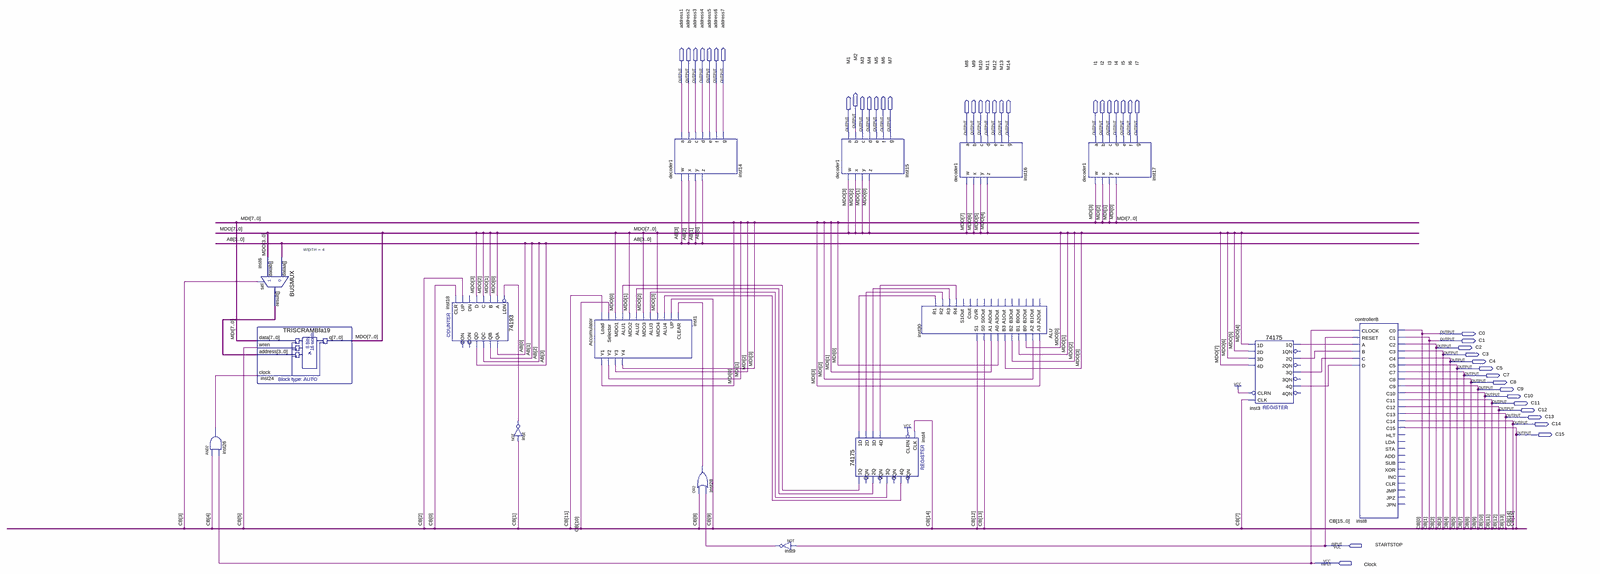
[diagram p0: schematic sheet, whole]
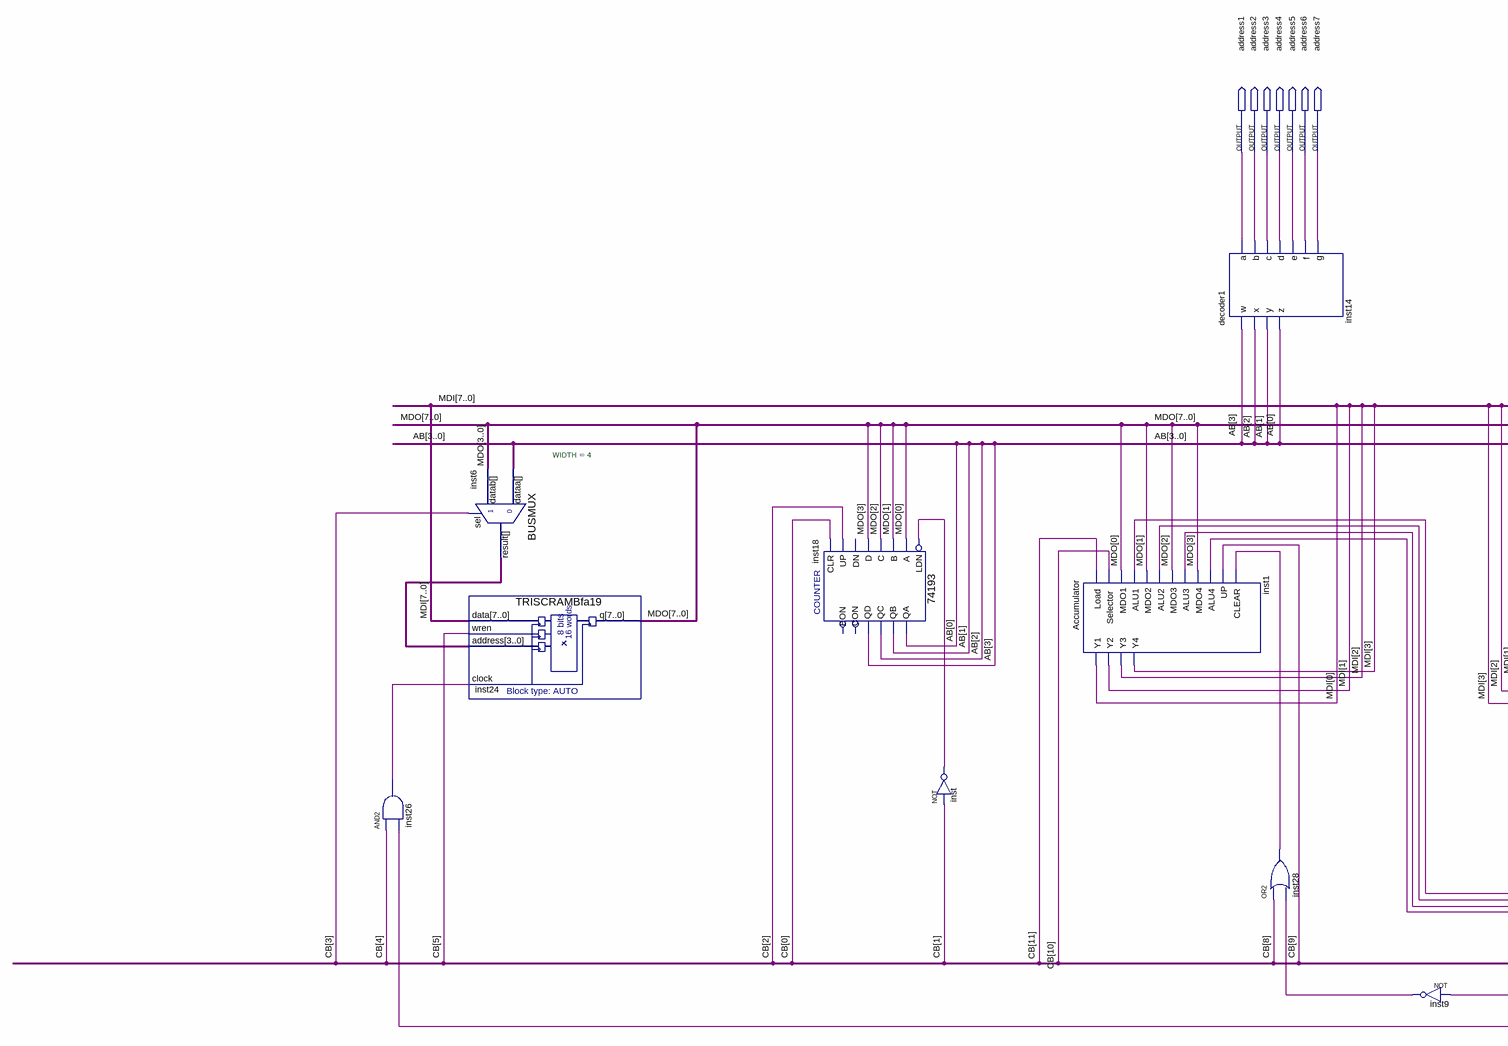
[diagram p1: schematic sheet, left part]
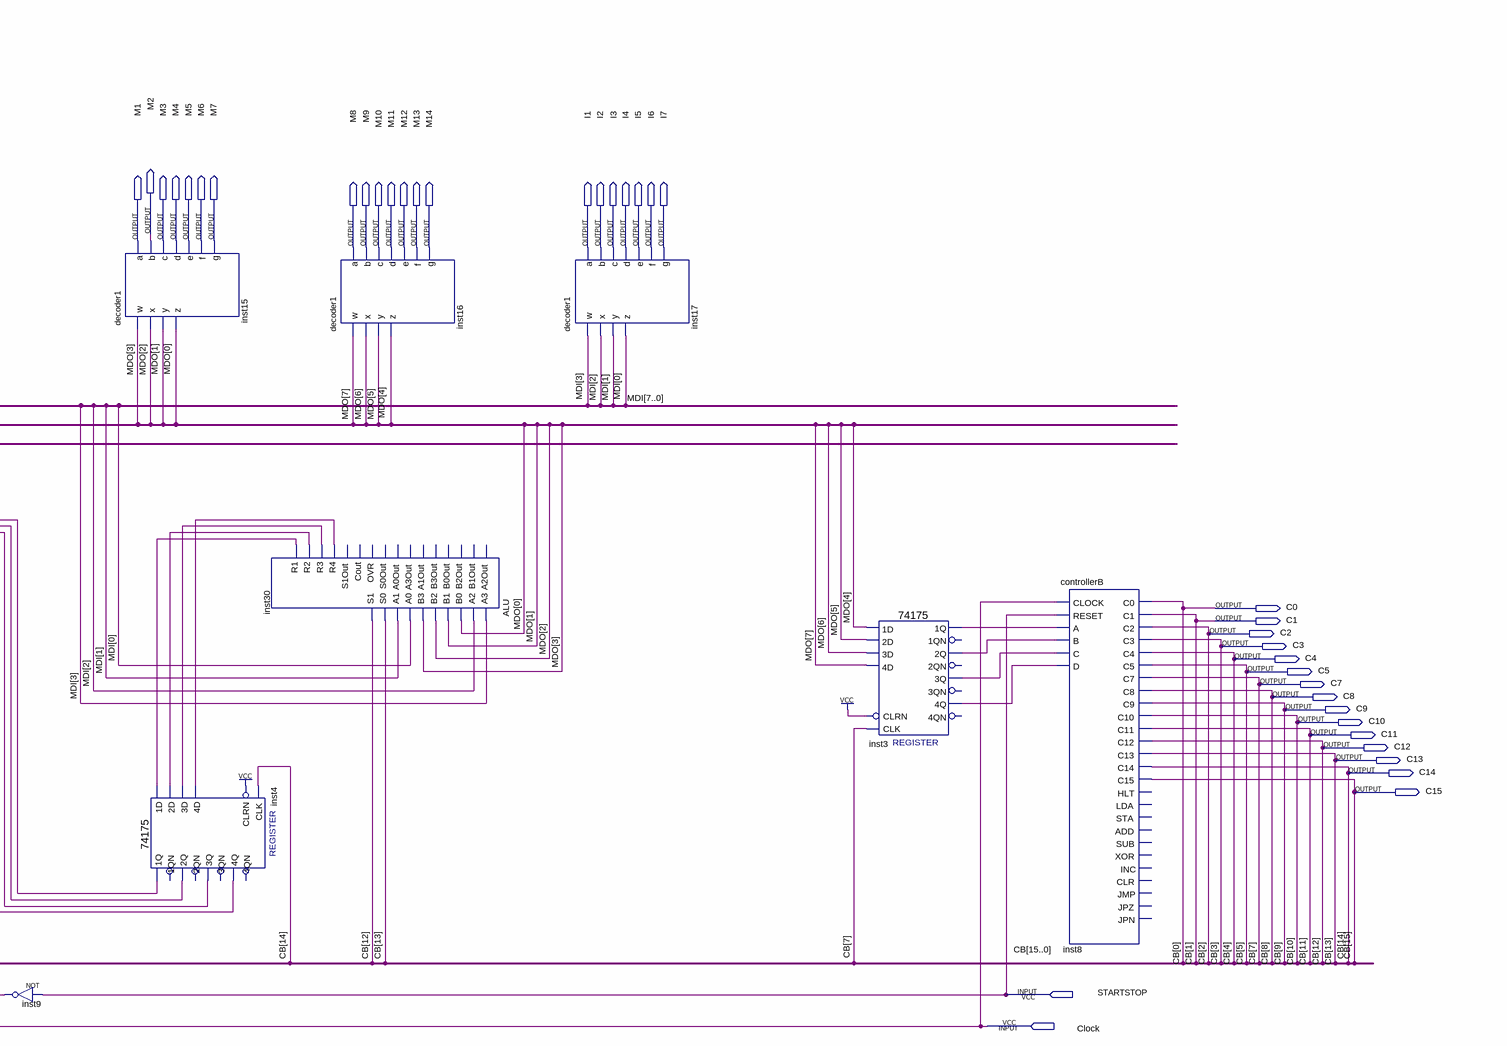
[diagram p2: schematic sheet, right part]
// Quartus schematic ProjectB.bdf as structural Verilog: 16 symbols, 45 pins
module ProjectB (
  input  STARTSTOP,
  input  Clock,
  output address1,
  output address2,
  output address3,
  output address4,
  output address5,
  output address6,
  output address7,
  output M2,
  output M1,
  output M3,
  output M4,
  output M5,
  output M6,
  output M7,
  output M8,
  output M9,
  output M10,
  output M11,
  output M12,
  output M13,
  output M14,
  output I1,
  output I2,
  output I3,
  output I4,
  output I5,
  output I6,
  output I7,
  output C0,
  output C1,
  output C2,
  output C3,
  output C4,
  output C5,
  output C7,
  output C8,
  output C9,
  output C10,
  output C11,
  output C12,
  output C13,
  output C14,
  output C15
);

  wire inst3_1q, inst3_2q, inst3_3q, inst3_4q, inst4_1q, inst4_2q, inst4_3q, inst4_4q, inst9_out, inst26_out,
       inst28_out, inst30_r1, inst30_r2, inst30_r3, inst30_r4, inst_out;
  wire [3:0] AB, inst6_result;
  wire [7:0] MDI, MDO;

  and inst26 (inst26_out, C4, Clock);
  BUSMUX #(.WIDTH(4)) inst6 (.datab(MDO[3:0]), .sel(C3), .dataa(AB), .result(inst6_result));
  TRISCRAMBfa19 inst24 (.data(MDI), .wren(C5), .address(inst6_result), .clock(inst26_out), .q(MDO));
  \74193  inst18 (
    .D(MDO[3]), .C(MDO[2]), .B(MDO[1]), .A(MDO[0]), .CLR(C0), .UP(C2), .LDN(inst_out), .QB(AB[1]),
    .QA(AB[0]), .QD(AB[3]), .QC(AB[2]));  // open: DN, CON, BON
  not inst (inst_out, C1);
  Accumulator inst1 (
    .Load(C11), .Selector(C10), .MDO1(MDO[0]), .ALU1(inst4_1q), .MDO2(MDO[1]), .ALU2(inst4_2q),
    .MDO3(MDO[2]), .ALU3(inst4_3q), .MDO4(MDO[3]), .ALU4(inst4_4q), .UP(C9), .CLEAR(inst28_out), .Y1(MDI[0]),
    .Y2(MDI[1]), .Y3(MDI[2]), .Y4(MDI[3]));
  decoder1 inst14 (
    .w(AB[3]), .x(AB[2]), .y(AB[1]), .z(AB[0]), .a(address1), .b(address2), .c(address3), .d(address4),
    .e(address5), .f(address6), .g(address7));
  or inst28 (inst28_out, C8, inst9_out);
  not inst9 (inst9_out, STARTSTOP);
  decoder1 inst15 (
    .w(MDO[3]), .x(MDO[2]), .y(MDO[1]), .z(MDO[0]), .a(M1), .b(M2), .c(M3), .d(M4), .e(M5), .f(M6), .g(M7));
  \74175  inst4 (
    .CLRN(1'b1), .CLK(C14), .\3D (inst30_r3), .\2D (inst30_r2), .\1D (inst30_r1), .\4D (inst30_r4),
    .\1Q (inst4_1q), .\3Q (inst4_3q), .\2Q (inst4_2q), .\4Q (inst4_4q));  // open: 1QN, 2QN, 4QN, 3QN
  ALU inst30 (
    .A3(MDI[3]), .A2(MDI[2]), .B0(MDO[0]), .B1(MDO[1]), .B2(MDO[2]), .B3(MDO[3]), .A0(MDI[0]), .A1(MDI[1]),
    .S0(C13), .S1(C12), .R4(inst30_r4), .R3(inst30_r3), .R2(inst30_r2), .R1(inst30_r1));  // open: A2Out, B1Out, B2Out, B0Out, B3Out, A1Out, A3Out, A0Out, S0Out, OVR, Cout, S1Out
  decoder1 inst16 (
    .w(MDO[7]), .x(MDO[6]), .y(MDO[5]), .z(MDO[4]), .a(M8), .b(M9), .c(M10), .d(M11), .e(M12), .f(M13),
    .g(M14));
  decoder1 inst17 (
    .w(MDI[3]), .x(MDI[2]), .y(MDI[1]), .z(MDI[0]), .a(I1), .b(I2), .c(I3), .d(I4), .e(I5), .f(I6), .g(I7));
  \74175  inst3 (
    .CLRN(1'b1), .CLK(C7), .\3D (MDO[6]), .\2D (MDO[5]), .\1D (MDO[4]), .\4D (MDO[7]), .\1Q (inst3_1q),
    .\3Q (inst3_3q), .\2Q (inst3_2q), .\4Q (inst3_4q));  // open: 1QN, 2QN, 4QN, 3QN
  controllerB inst8 (
    .CLOCK(Clock), .RESET(STARTSTOP), .A(inst3_1q), .B(inst3_2q), .C(inst3_3q), .D(inst3_4q), .C0(C0),
    .C1(C1), .C2(C2), .C3(C3), .C4(C4), .C5(C5), .C7(C7), .C8(C8), .C9(C9), .C10(C10), .C11(C11), .C12(C12),
    .C13(C13), .C14(C14), .C15(C15));  // open: HLT, LDA, STA, ADD, SUB, XOR, INC, CLR, JMP, JPZ, JPN

  // Other names for the same wires on the sheet: CB (some bits) = {C15, C14, C13, C12, C11, C10, C9, C8, C7, C5, C4, C3, C2, C1, C0}
endmodule
